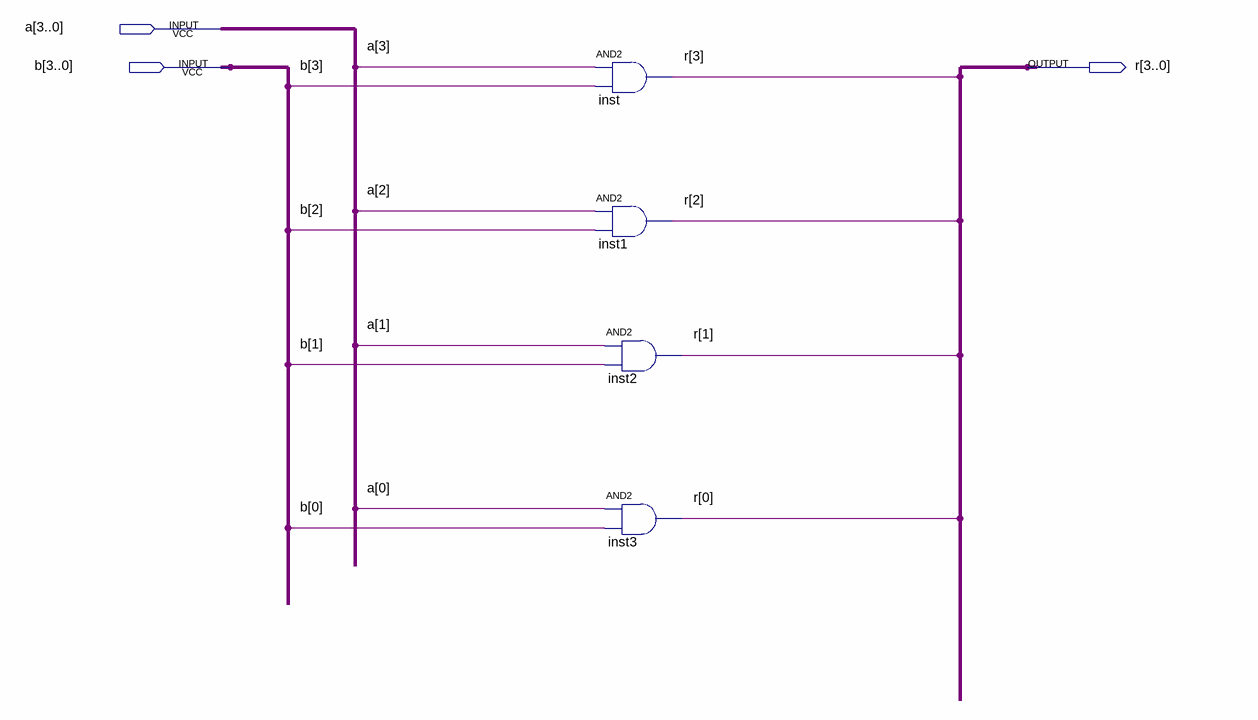
[diagram p0: schematic sheet]
// Quartus schematic bit_wise_and.bdf as structural Verilog: 4 symbols, 3 pins
module bit_wise_and (
  input  [3:0] a,
  input  [3:0] b,
  output [3:0] r
);

  and inst (r[3], a[3], b[3]);
  and inst1 (r[2], a[2], b[2]);
  and inst2 (r[1], a[1], b[1]);
  and inst3 (r[0], a[0], b[0]);
endmodule
